# Altium schematic sheet Sheet1.SchDoc
size A4
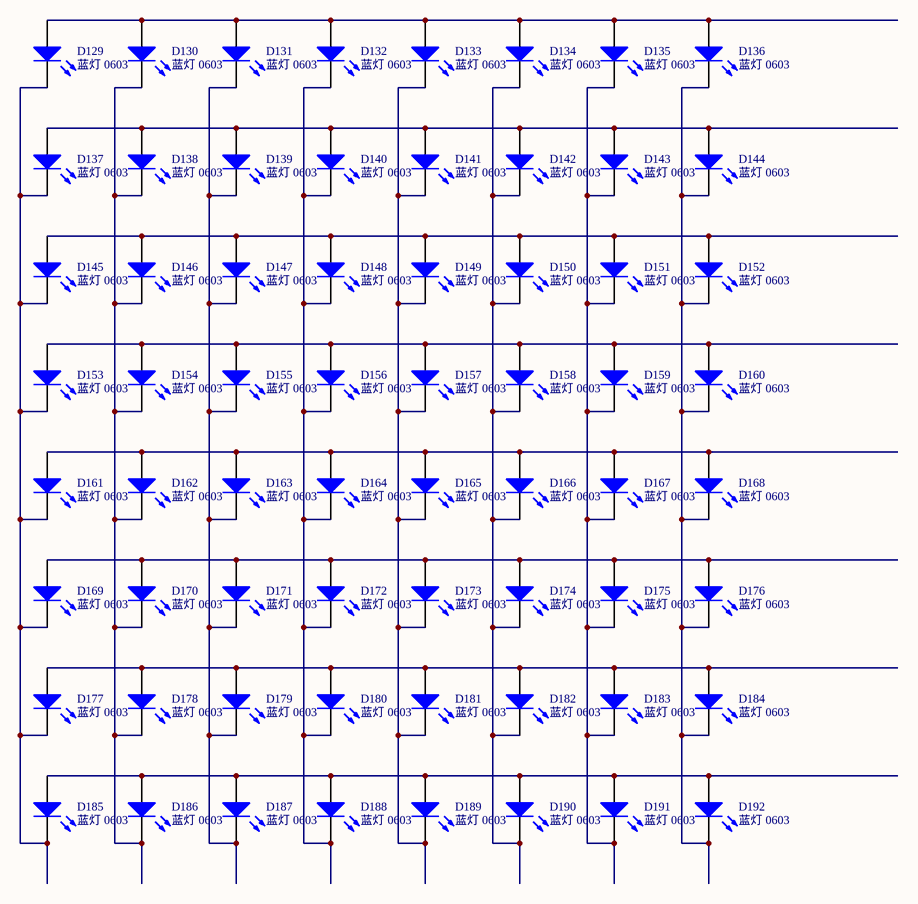
[diagram p0: Sheet1.SchDoc]

## Parts
D129  蓝灯 0603  [0603_LED_S1]
D130  蓝灯 0603  [0603_LED_S1]
D131  蓝灯 0603  [0603_LED_S1]
D132  蓝灯 0603  [0603_LED_S1]
D133  蓝灯 0603  [0603_LED_S1]
D134  蓝灯 0603  [0603_LED_S1]
D135  蓝灯 0603  [0603_LED_S1]
D136  蓝灯 0603  [0603_LED_S1]
D137  蓝灯 0603  [0603_LED_S1]
D138  蓝灯 0603  [0603_LED_S1]
D139  蓝灯 0603  [0603_LED_S1]
D140  蓝灯 0603  [0603_LED_S1]
D141  蓝灯 0603  [0603_LED_S1]
D142  蓝灯 0603  [0603_LED_S1]
D143  蓝灯 0603  [0603_LED_S1]
D144  蓝灯 0603  [0603_LED_S1]
D145  蓝灯 0603  [0603_LED_S1]
D146  蓝灯 0603  [0603_LED_S1]
D147  蓝灯 0603  [0603_LED_S1]
D148  蓝灯 0603  [0603_LED_S1]
D149  蓝灯 0603  [0603_LED_S1]
D150  蓝灯 0603  [0603_LED_S1]
D151  蓝灯 0603  [0603_LED_S1]
D152  蓝灯 0603  [0603_LED_S1]
D153  蓝灯 0603  [0603_LED_S1]
D154  蓝灯 0603  [0603_LED_S1]
D155  蓝灯 0603  [0603_LED_S1]
D156  蓝灯 0603  [0603_LED_S1]
D157  蓝灯 0603  [0603_LED_S1]
D158  蓝灯 0603  [0603_LED_S1]
D159  蓝灯 0603  [0603_LED_S1]
D160  蓝灯 0603  [0603_LED_S1]
D161  蓝灯 0603  [0603_LED_S1]
D162  蓝灯 0603  [0603_LED_S1]
D163  蓝灯 0603  [0603_LED_S1]
D164  蓝灯 0603  [0603_LED_S1]
D165  蓝灯 0603  [0603_LED_S1]
D166  蓝灯 0603  [0603_LED_S1]
D167  蓝灯 0603  [0603_LED_S1]
D168  蓝灯 0603  [0603_LED_S1]
D169  蓝灯 0603  [0603_LED_S1]
D170  蓝灯 0603  [0603_LED_S1]
D171  蓝灯 0603  [0603_LED_S1]
D172  蓝灯 0603  [0603_LED_S1]
D173  蓝灯 0603  [0603_LED_S1]
D174  蓝灯 0603  [0603_LED_S1]
D175  蓝灯 0603  [0603_LED_S1]
D176  蓝灯 0603  [0603_LED_S1]
D177  蓝灯 0603  [0603_LED_S1]
D178  蓝灯 0603  [0603_LED_S1]
D179  蓝灯 0603  [0603_LED_S1]
D180  蓝灯 0603  [0603_LED_S1]
D181  蓝灯 0603  [0603_LED_S1]
D182  蓝灯 0603  [0603_LED_S1]
D183  蓝灯 0603  [0603_LED_S1]
D184  蓝灯 0603  [0603_LED_S1]
D185  蓝灯 0603  [0603_LED_S1]
D186  蓝灯 0603  [0603_LED_S1]
D187  蓝灯 0603  [0603_LED_S1]
D188  蓝灯 0603  [0603_LED_S1]
D189  蓝灯 0603  [0603_LED_S1]
D190  蓝灯 0603  [0603_LED_S1]
D191  蓝灯 0603  [0603_LED_S1]
D192  蓝灯 0603  [0603_LED_S1]

## Nets
NetD129_A: D129.A D130.A D131.A D132.A D133.A D134.A D135.A D136.A
NetD129_K: D129.K D137.K D145.K D153.K D161.K D169.K D177.K D185.K
NetD130_K: D130.K D138.K D146.K D154.K D162.K D170.K D178.K D186.K
NetD131_K: D131.K D139.K D147.K D155.K D163.K D171.K D179.K D187.K
NetD132_K: D132.K D140.K D148.K D156.K D164.K D172.K D180.K D188.K
NetD133_K: D133.K D141.K D149.K D157.K D165.K D173.K D181.K D189.K
NetD134_K: D134.K D142.K D150.K D158.K D166.K D174.K D182.K D190.K
NetD135_K: D135.K D143.K D151.K D159.K D167.K D175.K D183.K D191.K
NetD136_K: D136.K D144.K D152.K D160.K D168.K D176.K D184.K D192.K
NetD137_A: D137.A D138.A D139.A D140.A D141.A D142.A D143.A D144.A
NetD145_A: D145.A D146.A D147.A D148.A D149.A D150.A D151.A D152.A
NetD153_A: D153.A D154.A D155.A D156.A D157.A D158.A D159.A D160.A
NetD161_A: D161.A D162.A D163.A D164.A D165.A D166.A D167.A D168.A
NetD169_A: D169.A D170.A D171.A D172.A D173.A D174.A D175.A D176.A
NetD177_A: D177.A D178.A D179.A D180.A D181.A D182.A D183.A D184.A
NetD185_A: D185.A D186.A D187.A D188.A D189.A D190.A D191.A D192.A

## Library data of the parts
D129-D192 = 0603 蓝灯: 发光二极管; ComponentLink1Description: 供应商链接; ComponentLink1URL: http://www.szlcsc.com/product/details_73150.html; Package: 0603; Supplier: LC; SuppliersPartNumber: C72041